# Altium schematic sheet MT8365_Other.SchDoc
size A4; SheetNumber: 9; SheetTotal: 36
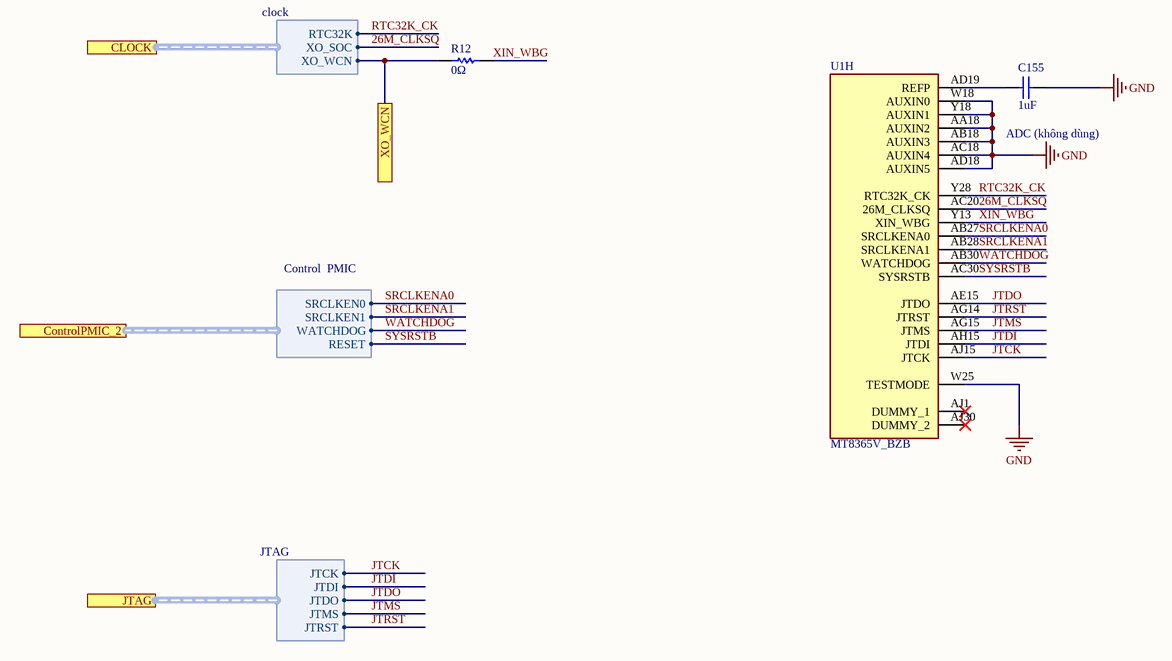
[diagram p0: MT8365_Other.SchDoc]

## Parts
C155  value 1uF  [C0805]  (hidden comment: C0805)
R12  value 0Ω  [R0603]  (hidden comment: R0603)
U1  MT8365V_BZB  [BGA633C40P30X29_1220X1180X90]  (part H of 10)

## Ports
CLOCK (harness clock, see MT8365[9500,4500], MT8365[11000,4500], Power[11000,5700], RTC_Miscellaneous[2500,1800]), ControlPMIC_2 (harness Control  PMIC, see MT8365[9500,4800], Control_Interface[3100,2200], MT8365[11000,4800], Power[9700,9000]), JTAG (harness JTAG, see MT8365[9500,4200], JTAG_Connector[2000,4100], MT8365[11000,4200]), XO_WCN (see MT8365[8200,4800], MT8365_CONN[3500,8600])

## Harnesses
Control  PMIC: WATCHDOG, SRCLKEN0, SRCLKEN1, RESET
clock: RTC32K, XO_SOC, XO_WCN
JTAG: JTCK, JTDI, JTDO, JTMS, JTRST

## Nets
GND: C155.1 U1.AA18(AUXIN2) U1.AB18(AUXIN3) U1.AC18(AUXIN4) U1.AD18(AUXIN5) U1.W18(AUXIN0) U1.W25(TESTMODE) U1.Y18(AUXIN1)
26M_CLKSQ: U1.AC20(26M_CLKSQ) ; port CLOCK.XO_SOC
JTCK: U1.AJ15(JTCK) ; port JTAG.JTCK
JTDI: U1.AH15(JTDI) ; port JTAG.JTDI
JTDO: U1.AE15(JTDO) ; port JTAG.JTDO
JTMS: U1.AG15(JTMS) ; port JTAG.JTMS
JTRST: U1.AG14(JTRST) ; port JTAG.JTRST
RTC32K_CK: U1.Y28(RTC32K_CK) ; port CLOCK.RTC32K
SRCLKENA0: U1.AB27(SRCLKENA0) ; port ControlPMIC_2.SRCLKEN0
SRCLKENA1: U1.AB28(SRCLKENA1) ; port ControlPMIC_2.SRCLKEN1
SYSRSTB: U1.AC30(SYSRSTB) ; port ControlPMIC_2.RESET
WATCHDOG: U1.AB30(WATCHDOG) ; port ControlPMIC_2.WATCHDOG
XIN_WBG: R12.2 U1.Y13(XIN_WBG)
XO_WCN: R12.1 ; port XO_WCN, port CLOCK.XO_WCN
NetC155_2: C155.2 U1.AD19(REFP)

Not connected (* = marked no-connect by the designer): U1 AJ1(DUMMY_1)* AJ30(DUMMY_2)*

## Notes on the sheet
- (near C155) ADC (không dùng)

## Library data of the parts
U1 = MT8365V_BZB: SoC; Manufacturer_Name: Mediatek; Manufacturer_Part_Number: MT8365V/BZB; Datasheet Link: https://www.mouser.co.uk/datasheet/2/1074/MT8365_AIoT_Application_Processor_Datasheet_v1_0_2-3106631.pdf; Height: 0.9mm; Mouser Part Number: 840-MT8365V/BZB; Mouser Price/Stock: https://www.mouser.co.uk/ProductDetail/MediaTek/MT8365V-BZB?qs=Jm2GQyTW%2FbjcedX9ugwNWQ%3D%3D